# EAGLE schematic MD_manuf (EAGLE 8.7.0)
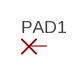
[diagram p0: schematic, sheet 1]

## Parts
PAD1  1,6/0,8  [1,6/0,8]
Unconnected: PAD1.1(P)

## Library data of the parts
PAD1 = wirepad:1,6/0,8: THROUGH-HOLE PAD